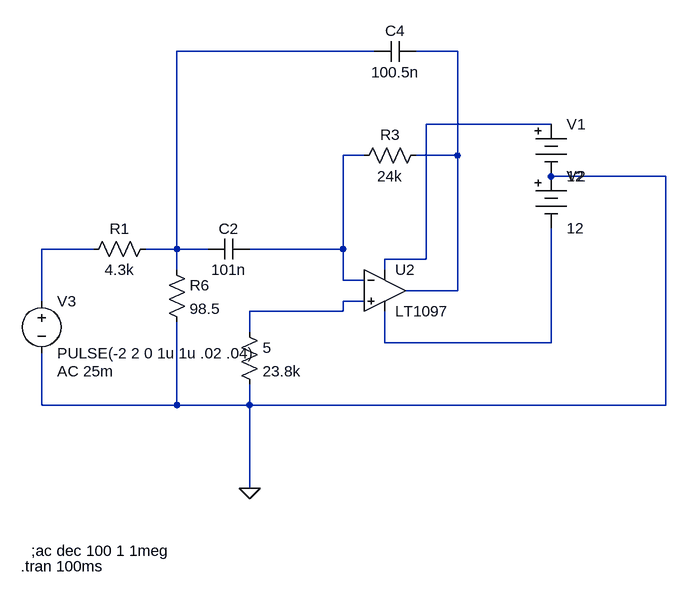
[diagram p0: schematic lab3Scheme.asc]
lab3Scheme.asc, the LTspice schematic file:
Version 4
SHEET 1 880 696
WIRE 352 -160 48 -160
WIRE 480 -160 416 -160
WIRE 624 -48 432 -48
WIRE 336 0 304 0
WIRE 480 0 480 -160
WIRE 480 0 416 0
WIRE 800 32 624 32
WIRE -80 144 -160 144
WIRE 48 144 48 -160
WIRE 48 144 0 144
WIRE 96 144 48 144
WIRE 304 144 304 0
WIRE 304 144 160 144
WIRE 432 160 432 -48
WIRE 432 160 368 160
WIRE 48 176 48 144
WIRE 368 176 368 160
WIRE 304 192 304 144
WIRE 336 192 304 192
WIRE 480 208 480 0
WIRE 480 208 400 208
WIRE -160 224 -160 144
WIRE 336 224 304 224
WIRE 304 240 304 224
WIRE 304 240 160 240
WIRE 160 272 160 240
WIRE 368 288 368 240
WIRE 624 288 624 112
WIRE 624 288 368 288
WIRE -160 384 -160 304
WIRE 48 384 48 256
WIRE 48 384 -160 384
WIRE 160 384 160 352
WIRE 160 384 48 384
WIRE 800 384 800 32
WIRE 800 384 160 384
WIRE 160 512 160 384
FLAG 160 512 0
SYMBOL res 16 128 R90
WINDOW 0 0 56 VBottom 2
WINDOW 3 32 56 VTop 2
SYMATTR InstName R1
SYMATTR Value 4.3k
SYMBOL res 432 -16 R90
WINDOW 0 0 56 VBottom 2
WINDOW 3 32 56 VTop 2
SYMATTR InstName R3
SYMATTR Value 24k
SYMBOL res 144 256 R0
SYMATTR InstName 5
SYMATTR Value 23.8k
SYMBOL Misc\\battery 624 -64 R0
WINDOW 123 0 0 Left 0
WINDOW 39 0 0 Left 0
SYMATTR InstName V1
SYMATTR Value 12
SYMBOL Misc\\battery 624 16 R0
WINDOW 123 0 0 Left 0
WINDOW 39 0 0 Left 0
SYMATTR InstName V2
SYMATTR Value 12
SYMBOL voltage -160 208 R0
WINDOW 123 24 124 Left 2
WINDOW 39 0 0 Left 0
SYMATTR Value2 AC 25m
SYMATTR InstName V3
SYMATTR Value PULSE(-2 2 0 1u 1u .02 .04)
SYMBOL OpAmps\\LT1097 368 144 R0
SYMATTR InstName U2
SYMBOL cap 160 128 R90
WINDOW 0 0 32 VBottom 2
WINDOW 3 32 32 VTop 2
SYMATTR InstName C2
SYMATTR Value 101n
SYMBOL cap 416 -176 R90
WINDOW 0 0 32 VBottom 2
WINDOW 3 32 32 VTop 2
SYMATTR InstName C4
SYMATTR Value 100.5n
SYMBOL res 32 160 R0
SYMATTR InstName R6
SYMATTR Value 98.5
TEXT -176 608 Left 2 !;ac dec 100 1 1meg
TEXT -192 632 Left 2 !.tran 100ms

The netlist it stands for:
* lab3Scheme.asc
R1 N001 N005 4.3k
R3 N002 N004 24k
R§5 N006 0 23.8k
V1 N003 0 12
V2 0 N007 12
V3 N005 0 PULSE(-2 2 0 1u 1u .02 .04) AC 25m
XU2 N006 N004 N003 N007 N002 LT1097  ; pins In+ In- V+ V- OUT
C2 N004 N001 101n
C4 N002 N001 100.5n
R6 N001 0 98.5
;ac dec 100 1 1meg
.tran 100ms
.backanno
.end